# Altium schematic sheet pca63519 - TouchPad.SchDoc: PCA63519 - Smart Remote 3 DK shield - Touch Pad
size A4; DocumentNumber: 6; Revision: 1.2.1; SheetNumber: 6; SheetTotal: 6; DrawnBy: GETR; ProjectNumber: 4414; DocumentSize: A4; PCBRevision: 0049GETR; PCAName: PCA63519; PCBNumber: 400129
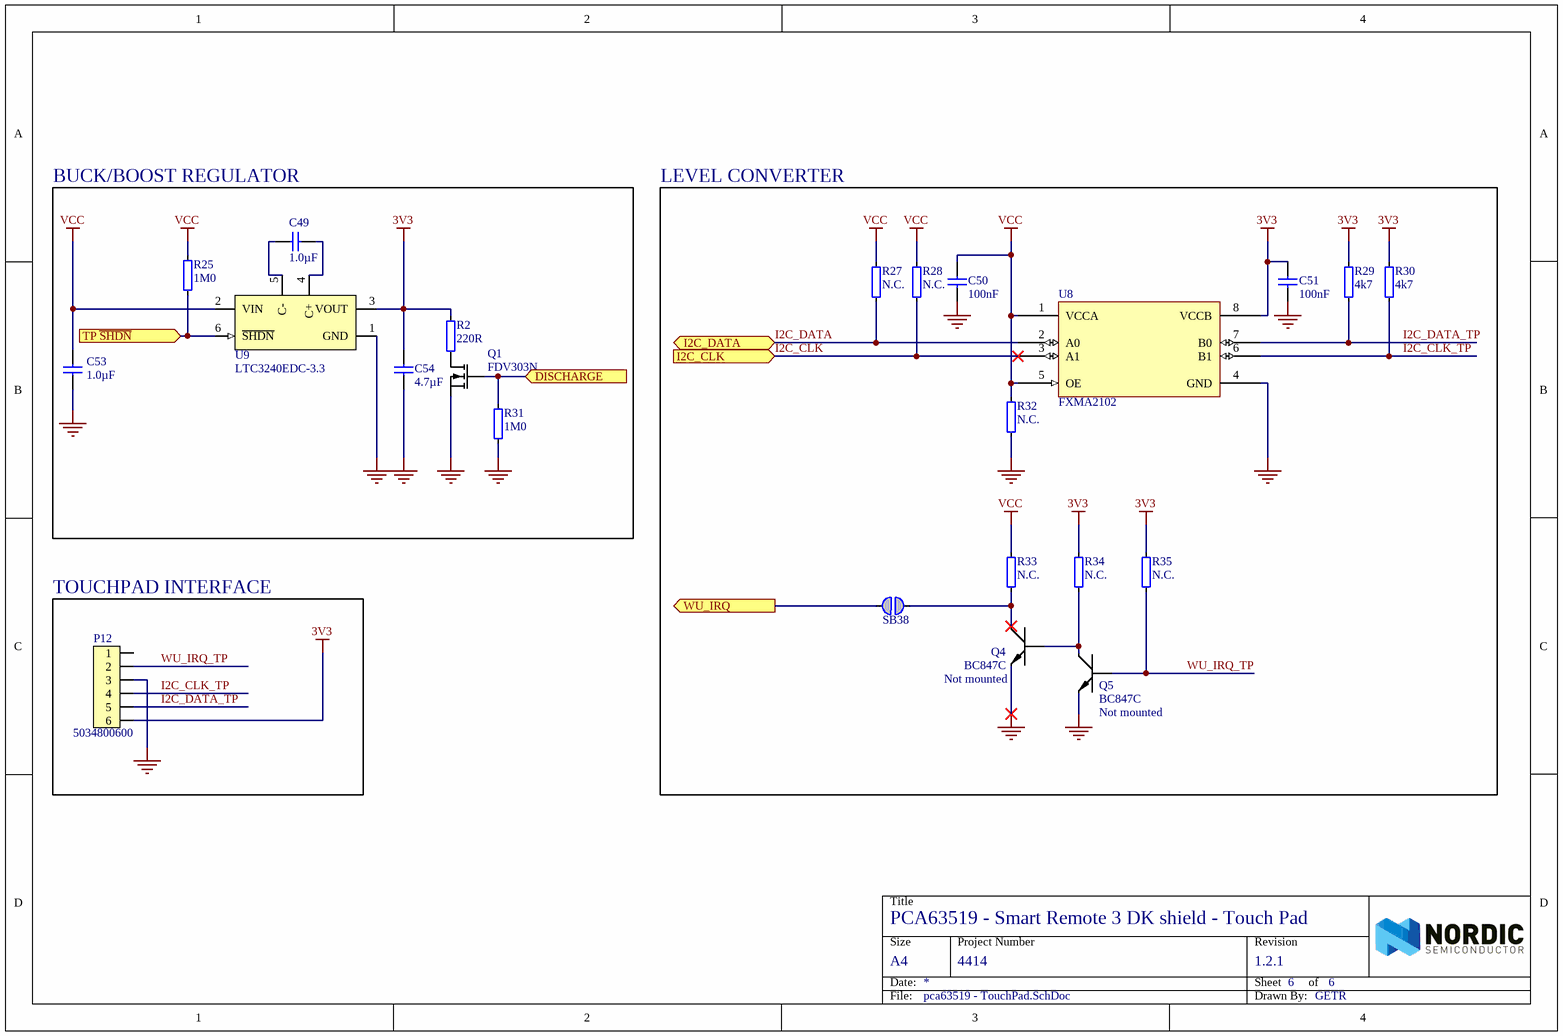
[diagram p0: pca63519 - TouchPad.SchDoc]

## Parts
C49  1.0µF  [CAPC1005X04L]
C50  100nF  [CAPC1005X04L]
C51  100nF  [CAPC1005X04L]
C53  1.0µF  [CAPC1005X04L]
C54  4.7µF  [CAPC1005X04L]
P12  5034800600  [Molex 5034800600]
Q1  FDV303N  [SOT-23a]
Q4  BC847C  Assembly: Not mounted  [SOT-23a]
Q5  BC847C  Assembly: Not mounted  [SOT-23a]
R2  220R  [RESC1005X04L]
R25  1M0  [RESC1005X04L]
R27  N.C.  [RESC1005X04L]
R28  N.C.  [RESC1005X04L]
R29  4k7  [RESC1005X04L]
R30  4k7  [RESC1005X04L]
R31  1M0  [RESC1005X04L]
R32  N.C.  [RESC1005X04L]
R33  N.C.  [RESC1005X04L]
R34  N.C.  [RESC1005X04L]
R35  N.C.  [RESC1005X04L]
SB38  Solderbridge  [Solderbridge_0.4]  (value not drawn)  (no BOM)
U8  FXMA2102  [QFN40P140X120X55-8N]
U9  LTC3240EDC-3.3  [SON50P200X80_HS-7N]

## Blocks framed on the sheet
BUCK/BOOST REGULATOR: C49 C53 C54 Q1 R2 R25 R31 U9
LEVEL CONVERTER: C50 C51 Q4 Q5 R27-R30 R32-R35 SB38 U8
TOUCHPAD INTERFACE: P12

## Ports
DISCHARGE (in), I2C_CLK (in), I2C_DATA (bidir), TP ~{SHDN} (in), WU_IRQ (out)

## Nets
3V3: C51.2 C54.2 P12.6 R2.2 R29.1 R30.1 R34.1 R35.1 U8.8(VCCB) U9.3(VOUT)
GND: C50.1 C51.1 C53.1 C54.1 P12.3 Q1.2(S) Q4.2(E) Q5.2(E) R31.1 R32.2 U8.4(GND) U9.1(GND) U9.7(GND)
VCC: C50.2 C53.2 R25.2 R27.1 R28.1 R32.1 R33.1 U8.1(VCCA) U8.5(OE) U9.2(VIN)
DISCHARGE: Q1.1(G) R31.2 ; port DISCHARGE
I2C_CLK: R28.2 U8.3(A1) ; port I2C_CLK
I2C_CLK_TP: P12.4 R30.2 U8.6(B1)
I2C_DATA: R27.2 U8.2(A0) ; port I2C_DATA
I2C_DATA_TP: P12.5 R29.2 U8.7(B0)
TP ~{SHDN}: R25.1 U9.6(~{SHDN}) ; port TP ~{SHDN}
WU_IRQ: SB38.2 ; port WU_IRQ
WU_IRQ_TP: P12.2 Q5.1(B) R35.2
NetC49_1: C49.1 U9.4(C+)
NetC49_2: C49.2 U9.5(C-)
NetQ1_3: Q1.3(D) R2.1
NetQ4_1: Q4.1(B) Q5.3(C) R34.2
NetQ4_3: Q4.3(C) R33.2 SB38.1

Not connected (* = marked no-connect by the designer): P12 1

## Notes on the sheet
- Title
- Size
- Date:
- Project Number
- Sheet         of
- Revision
- File:
- Drawn By:

## Library data of the parts
C49 C53 = C0402-1µ0: Capacitor, X5R, ±5%; Note: 6.3V; Artikkelnr Noca: 20039235; Artikkelnr Simpro: N.A.; Part Number: C0402-1µ0; Manufacturer: *; Manufacturer Part Number: *; Datasheet: *; Footprint Doc: 0402; LatestRevisionDate: 2016-08-22; Pin Count: 2; Publisher: Nordic Semiconductor; Published: 2009-05-08; Value: 1.0µF; Supplier: Digi-Key; Supplier part number: 1276-1444-1-ND; 2nd source Supplier: *; 2nd source part number: *
C50 C51 = C0402-100n: Capacitor, X7R, ±10%; Note: 16V; Artikkelnr Noca: 20039200; Artikkelnr Simpro: N.A.; Part Number: C0402-100n; Manufacturer: *; Manufacturer Part Number: *; Datasheet: *; Footprint Doc: 0402; LatestRevisionDate: 2009-11-23; Pin Count: 2; Publisher: Nordic Semiconductor; Published: 2009-05-08; Value: 100nF; Supplier: *; Supplier part number: *; 2nd source Supplier: *; 2nd source part number: *
C54 = C0402-4µ7: Capacitor, X5R, ±20%; Note: 10V; Artikkelnr Noca: 20039482; Artikkelnr Simpro: N.A.; Part Number: C0402-4µ7; Manufacturer: *; Manufacturer Part Number: *; Datasheet: *; Footprint Doc: 0402; LatestRevisionDate: 2016-08-22; Pin Count: 2; Publisher: Nordic Semiconductor; Published: 2009-05-08; Value: 4.7µF; Supplier: Digi-Key; Supplier part number: 490-13252-1-ND; 2nd source Supplier: *; 2nd source part number: *
P12 = Molex 5034800600: CONN FFC FPC 6POS 0.50MM R/A; Manufacturer: Molex; Artikkelnr Noca: N.A.; Part Number: Molex 5034800600; Manufacturer Part Number: 5034800600; Datasheet: http://www.molex.com/pdm_docs/sd/5034800600_sd.pdf; Footprint Doc: Molex 5034800600; LatestRevisionDate: 2015-10-01; Pin Count: 8; Publisher: Nordic Semiconductor; Published: 2015-10-01; Value: 5034800600; Note: *; Supplier: Digi-Key; Supplier part number: WM1387TR-ND; 2nd source Supplier: *; 2nd source part number: *; Artikkelnr Simpro: N.A.
Q1 = FDV303N: Mosfet FDV303N; 2nd source part number: FDV303NCT-ND; Note: Schottky; Artikkelnr Noca: 35029048; Artikkelnr Simpro: N.A.; Part Number: FDV303N; Manufacturer: *; Manufacturer Part Number: *; Datasheet: *; Footprint Doc: SOT-23a; LatestRevisionDate: 2009-11-23; Pin Count: 3; Publisher: Nordic Semiconductor; Published: 2009-05-10; Value: FDV303N; Supplier: Farnell; Supplier part number: 984-5020; 2nd source Supplier: Digi-Key
Q4 Q5 = BC847C: BC847C, NPN Silicon transistor; Manufacturer: NXP; 2nd source part number: 568-1636-1-ND; Note: NPN Epitaxial Silicon Transistor; Artikkelnr Noca: 35019020; Artikkelnr Simpro: N.A.; Part Number: BC847C; Manufacturer Part Number: BC847C; Datasheet: *; Footprint Doc: SOT-23a; LatestRevisionDate: 2009-11-23; Pin Count: 3; Publisher: Nordic Semiconductor; Published: 2009-05-10; Value: BC847C; Supplier: Farnell; Supplier part number: 108-1235; 2nd source Supplier: Digi-Key
R2 = R0402-220: Resistor, ±1%, 0.063W; Note: Chip Res 1%; Artikkelnr Noca: 27049057; Artikkelnr Simpro: N.A.; Value Ohm: 220; Part Number: R0402-220; Manufacturer: *; Manufacturer Part Number: *; Datasheet: *; Footprint Doc: 0402; LatestRevisionDate: 2009-11-23; Pin Count: 2; Publisher: Nordic Semiconductor; Published: 2009-05-08; Value: 220R; Supplier: Farnell; Supplier part number: 173-8841; 2nd source Supplier: *; 2nd source part number: *
R25 R31 = R0402-1M0: Resistor, ±1%, 0.063W; Note: Chip Res 1%; Artikkelnr Noca: 27049145; Artikkelnr Simpro: N.A.; Value Ohm: 1000000; Part Number: R0402-1M0; Manufacturer: *; Manufacturer Part Number: *; Datasheet: *; Footprint Doc: 0402; LatestRevisionDate: 2009-11-23; Pin Count: 2; Publisher: Nordic Semiconductor; Published: 2009-05-08; Value: 1M0; Supplier: *; Supplier part number: *; 2nd source Supplier: *; 2nd source part number: *
R27 R28 R32-R35 = R0402-N.C.: Not mounted; Note: Chip Res; Artikkelnr Noca: N.A.; Assembly: Not mounted; Part Number: R0402-N.C.; Manufacturer: *; Manufacturer Part Number: *; Datasheet: *; LatestRevisionDate: 2009-05-08; Pin Count: 2; Publisher: Nordic Semiconductor; Published: 2009-05-08; Value: N.C.; Supplier: *; Supplier part number: *; 2nd source Supplier: *; 2nd source part number: *; Footprint Doc: 0402; Artikkelnr Simpro: N.A.
R29 R30 = R0402-4k7: Resistor, ±1%, 0.063W; Note: Chip Res 1%; Artikkelnr Noca: 27049089; Artikkelnr Simpro: N.A.; Value Ohm: 4700; Part Number: R0402-4k7; Manufacturer: *; Manufacturer Part Number: *; Datasheet: *; LatestRevisionDate: 2009-11-23; Pin Count: 2; Publisher: Nordic Semiconductor; Published: 2009-05-08; Value: 4k7; Supplier: Farnell; Supplier part number: 173-8858; 2nd source Supplier: *; 2nd source part number: *; Footprint Doc: 0402
SB38 = Solderbridge 0.4mm: Artikkelnr Noca: N.A.; Part Number: Solderbridge 0.4mm; Manufacturer: *; Manufacturer Part Number: *; Datasheet: *; Footprint Doc: Solderbridge; LatestRevisionDate: 2009-12-14; Pin Count: 2; Publisher: Nordic Semiconductor; Published: 2009-12-14; Value: Solderbridge; Note: *; Supplier: *; Supplier part number: *; 2nd source Supplier: *; 2nd source part number: *; Artikkelnr Simpro: N.A.
U8 = FXMA2102: XLATOR/BUFF/REPEAT/ISOLATR 8UMLPd; Manufacturer: Fairchild; Manufacturer Part Number: FXMA2102UMX; Artikkelnr Noca: N.A.; Part Number: FXMA2102; Datasheet: https://www.fairchildsemi.com/products/logic/voltage-level-translators/voltage-level-translators/FXMA2102.html?keyword=FXMA2102; Footprint Doc: UFQFN-8; LatestRevisionDate: 2015-04-29; Pin Count: 8; Publisher: Nordic Semiconductor; Published: 2015-04-29; Value: FXMA2102; Note: *; Supplier: Digi-Key; Supplier part number: FXMA2102UMXCT-ND; 2nd source Supplier: *; 2nd source part number: *; Artikkelnr Simpro: N.A.
U9 = LTC3240EDC-3.3: IC REG MULTI CONFIG 3.3V 6DFN; Manufacturer: Linear Technology; Manufacturer Part Number: LTC3240EDC-3.3#TRMPBF; Artikkelnr Noca: N.A.; Part Number: LTC3240EDC-3.3; Datasheet: http://www.linear.com/docs/14497; Footprint Doc: WFDFN-6; LatestRevisionDate: 2009-04-22; Pin Count: 7; Publisher: Nordic Semiconductor; Published: 2009-04-22; Value: LTC3240EDC-3.3; Note: *; Supplier: Digi-Key; Supplier part number: LTC3240EDC-3.3#TRMPBFCT-ND; 2nd source Supplier: *; 2nd source part number: *; Artikkelnr Simpro: N.A.